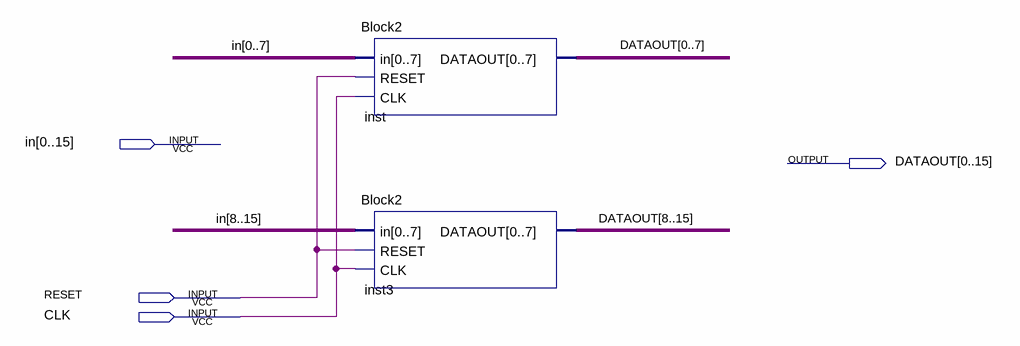
[diagram p0: schematic sheet]
// Quartus schematic Block3.bdf as structural Verilog: 2 symbols, 4 pins
module Block3 (
  input  [0:15] in,
  input  RESET,
  input  CLK,
  output [0:15] DATAOUT
);

  Block2 inst (.in(in[0:7]), .RESET(RESET), .CLK(CLK), .DATAOUT(DATAOUT[0:7]));
  Block2 inst3 (.in(in[8:15]), .RESET(RESET), .CLK(CLK), .DATAOUT(DATAOUT[8:15]));
endmodule
